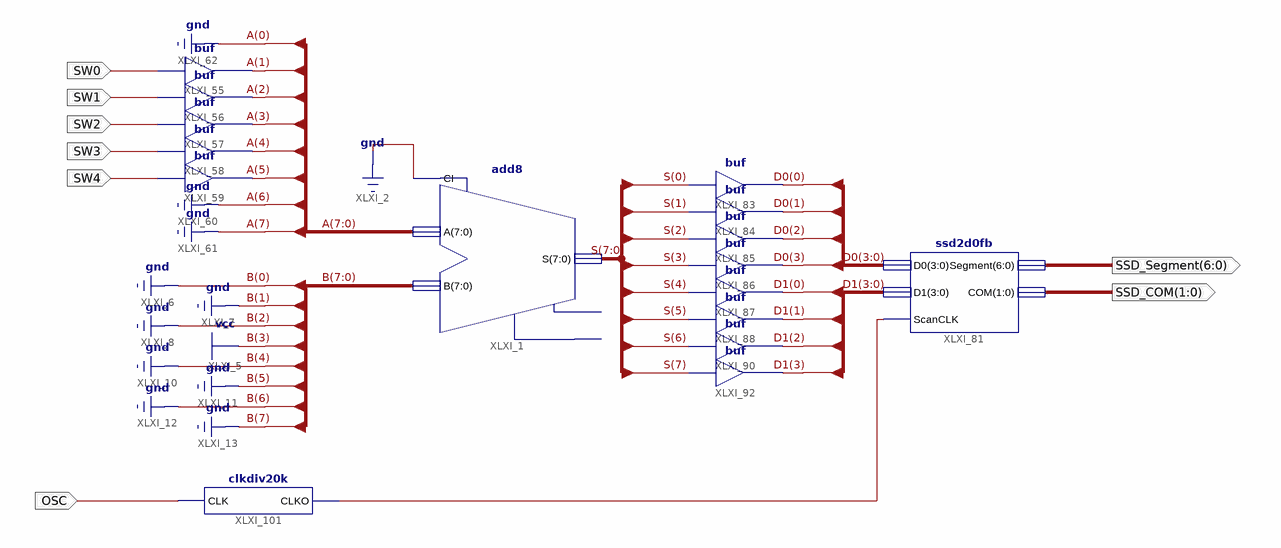
[diagram p0: schematic sheet 1]
// Xilinx ISE schematic main.sch (spartan6) as structural Verilog: 16 symbols, 8 ports
module main (
  input  SW0,
  input  SW1,
  input  SW2,
  input  SW3,
  input  SW4,
  input  OSC,
  output [1:0] SSD_COM,
  output [6:0] SSD_Segment
);

  wire XLXN_149;
  wire [3:0] D0, D1;
  wire [5:1] A;
  wire [7:0] S;

  add8 XLXI_1 (.A({2'b00, A, 1'b0}), .B(8'b00001000), .CI(1'b0), .S(S));  // open: CO, OFL
  buf XLXI_55 (A[1], SW0);
  buf XLXI_56 (A[2], SW1);
  buf XLXI_57 (A[3], SW2);
  buf XLXI_58 (A[4], SW3);
  buf XLXI_59 (A[5], SW4);
  ssd2d0fb XLXI_81 (.COM(SSD_COM), .D0(D0), .D1(D1), .ScanCLK(XLXN_149), .Segment(SSD_Segment));
  buf XLXI_83 (D0[0], S[0]);
  buf XLXI_84 (D0[1], S[1]);
  buf XLXI_85 (D0[2], S[2]);
  buf XLXI_86 (D0[3], S[3]);
  buf XLXI_87 (D1[0], S[4]);
  buf XLXI_88 (D1[1], S[5]);
  buf XLXI_90 (D1[2], S[6]);
  buf XLXI_92 (D1[3], S[7]);
  clkdiv20k XLXI_101 (.CLK(OSC), .CLKO(XLXN_149));
endmodule
